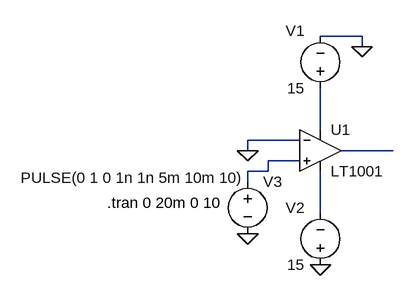
[diagram p0: schematic LT1001_lab2_q3f.asc]
LT1001_lab2_q3f.asc, the LTspice schematic file:
Version 4
SHEET 1 880 680
WIRE 160 64 96 64
WIRE 160 80 160 64
WIRE 96 208 96 144
WIRE 64 224 -16 224
WIRE -16 240 -16 224
WIRE 208 240 128 240
WIRE 64 256 16 256
WIRE 16 272 16 256
WIRE 16 272 -16 272
WIRE -16 288 -16 272
WIRE 96 336 96 272
FLAG 160 80 0
FLAG 96 416 0
FLAG -16 368 0
FLAG -16 240 0
SYMBOL Opamps\\LT1001 96 176 R0
SYMATTR InstName U1
SYMBOL voltage 96 160 R180
WINDOW 0 24 104 Left 0
WINDOW 3 24 16 Left 0
WINDOW 123 0 0 Left 0
WINDOW 39 0 0 Left 0
SYMATTR InstName V1
SYMATTR Value 15
SYMBOL voltage 96 432 R180
WINDOW 0 24 104 Left 0
WINDOW 3 24 16 Left 0
WINDOW 123 0 0 Left 0
WINDOW 39 0 0 Left 0
SYMATTR InstName V2
SYMATTR Value 15
SYMBOL voltage -16 272 R0
WINDOW 3 -349 10 Left 0
WINDOW 123 0 0 Left 0
WINDOW 39 0 0 Left 0
SYMATTR Value PULSE(0 1 0 1n 1n 5m 10m 10)
SYMATTR InstName V3
TEXT -232 320 Left 0 !.tran 0 20m 0 10

The netlist it stands for:
* LT1001_lab2_q3f.asc
XU1 N003 0 N001 N004 N002 LT1001  ; pins In+ In- V+ V- OUT
V1 N001 0 15
V2 0 N004 15
V3 N003 0 PULSE(0 1 0 1n 1n 5m 10m 10)
.tran 0 20m 0 10
.lib LTC.lib
.backanno
.end